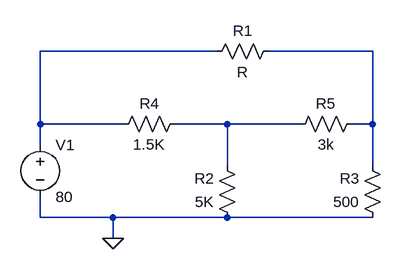
[diagram p0: schematic ad1.asc]
ad1.asc, the LTspice schematic file:
Version 4
SHEET 1 880 680
WIRE 416 64 144 64
WIRE 656 64 496 64
WIRE 144 176 144 64
WIRE 272 176 144 176
WIRE 432 176 352 176
WIRE 544 176 432 176
WIRE 656 176 656 64
WIRE 656 176 624 176
WIRE 144 208 144 176
WIRE 432 240 432 176
WIRE 656 240 656 176
WIRE 144 320 144 288
WIRE 256 320 144 320
WIRE 432 320 256 320
WIRE 656 320 432 320
WIRE 256 352 256 320
FLAG 256 352 0
SYMBOL voltage 144 192 R0
WINDOW 123 0 0 Left 0
WINDOW 39 0 0 Left 0
SYMATTR InstName V1
SYMATTR Value 80
SYMBOL res 512 48 R90
WINDOW 0 0 56 VBottom 2
WINDOW 3 32 56 VTop 2
SYMATTR InstName R1
SYMBOL res 448 336 R180
WINDOW 0 36 76 Left 2
WINDOW 3 36 40 Left 2
SYMATTR InstName R2
SYMATTR Value 5K
SYMATTR SpiceLine tol=1 pwr=0.1
SYMBOL res 672 336 R180
WINDOW 0 36 76 Left 2
WINDOW 3 36 40 Left 2
SYMATTR InstName R3
SYMATTR Value 500
SYMBOL res 368 160 R90
WINDOW 0 0 56 VBottom 2
WINDOW 3 32 56 VTop 2
SYMATTR InstName R4
SYMATTR Value 1.5K
SYMBOL res 640 160 R90
WINDOW 0 0 56 VBottom 2
WINDOW 3 32 56 VTop 2
SYMATTR InstName R5
SYMATTR Value 3k

The netlist it stands for:
* ad1.asc
V1 N001 0 80
R1 N002 N001 R
R2 0 N003 5K tol=1 pwr=0.1
R3 0 N002 500
R4 N003 N001 1.5K
R5 N002 N003 3k
.backanno
.end